# EAGLE design USB_SUPPLY (EAGLE 6.6.0)
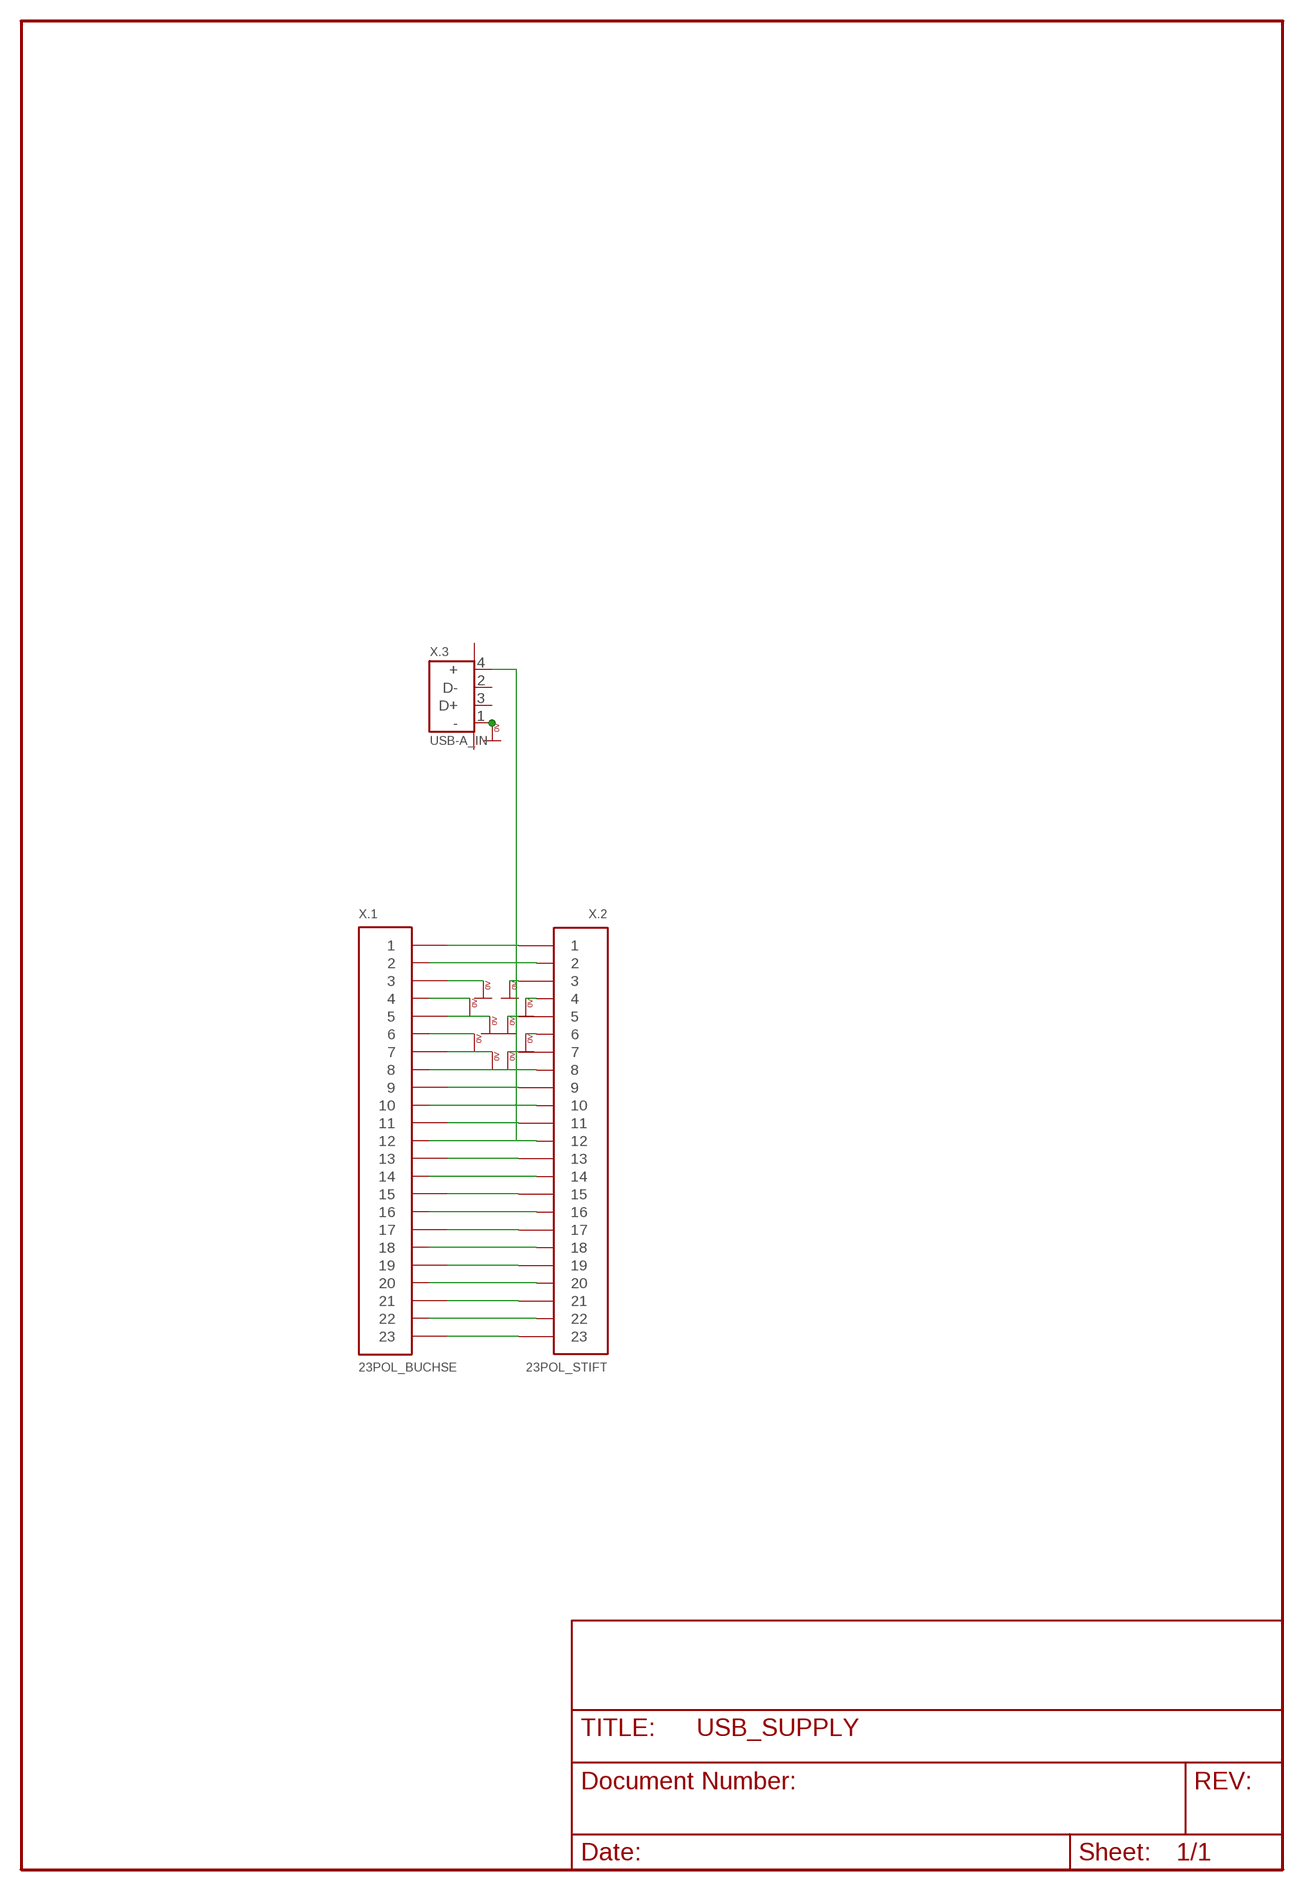
[diagram p0: schematic, sheet 1]

## Parts
X.1  23POL_BUCHSE  [SUB-D_23F_L]
X.2  23POL_STIFT  [SUB-D_23M_L]
X.3  USB-A_IN  [USB-A-90_IN]

## Nets
0V: X.1.3 X.1.4 X.1.5 X.1.6 X.1.7 X.2.3 X.2.4 X.2.5 X.2.6 X.2.7 X.3.1(-)
N$1: X.1.1 X.2.1
N$5: X.1.9 X.2.9
N$6: X.1.11 X.2.11
N$7: X.1.13 X.2.13
N$8: X.1.15 X.2.15
N$9: X.1.17 X.2.17
N$10: X.1.19 X.2.19
N$11: X.1.21 X.2.21
N$12: X.1.23 X.2.23
N$13: X.1.2 X.2.2
N$16: X.1.8 X.2.8
N$17: X.1.10 X.2.10
N$18: X.1.12 X.2.12 X.3.4(+)
N$19: X.1.14 X.2.14
N$20: X.1.16 X.2.16
N$21: X.1.18 X.2.18
N$22: X.1.20 X.2.20
N$23: X.1.22 X.2.22
Unconnected: X.3.2(D-) X.3.3(D+) X.3.P$1(GND) X.3.P$2(GND)

## Library data of the parts
X.1 X.2 = de_connectors:23POL
X.3 = de_connectors:USB-A

## Board
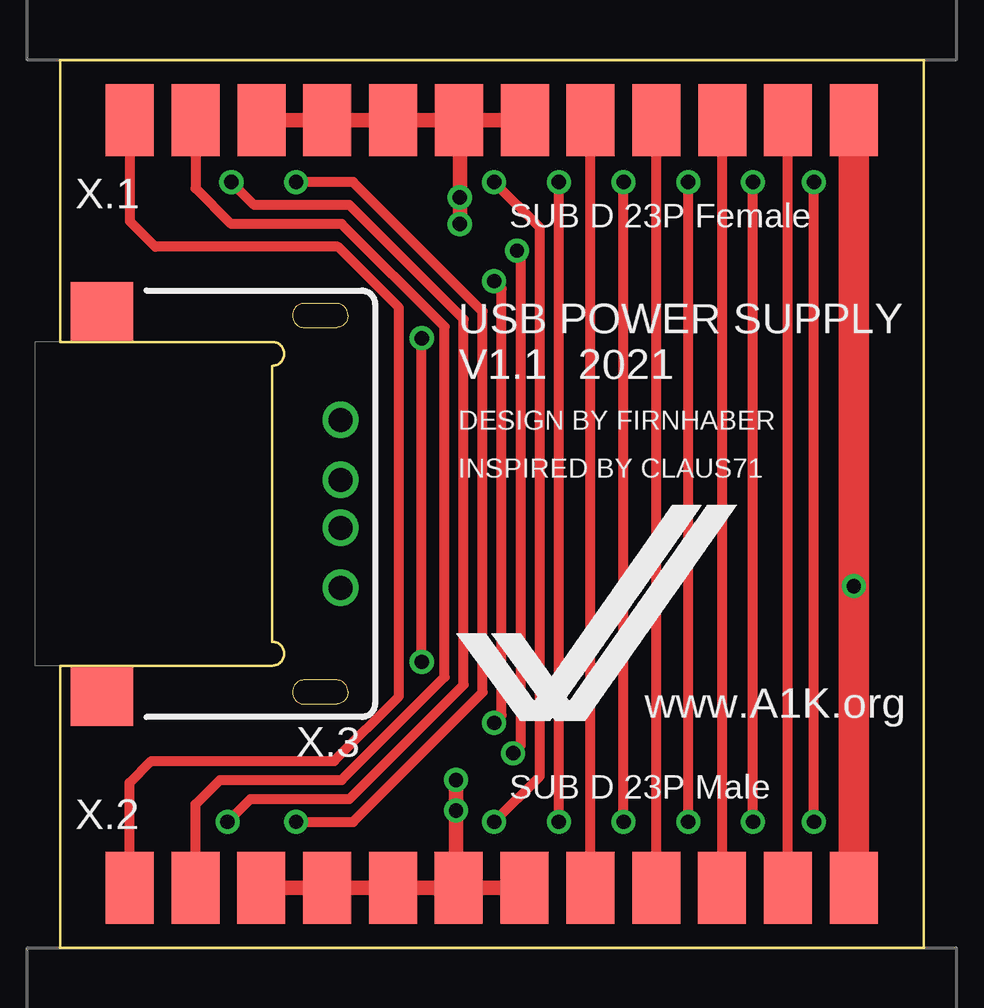
[diagram p1: board, top side]
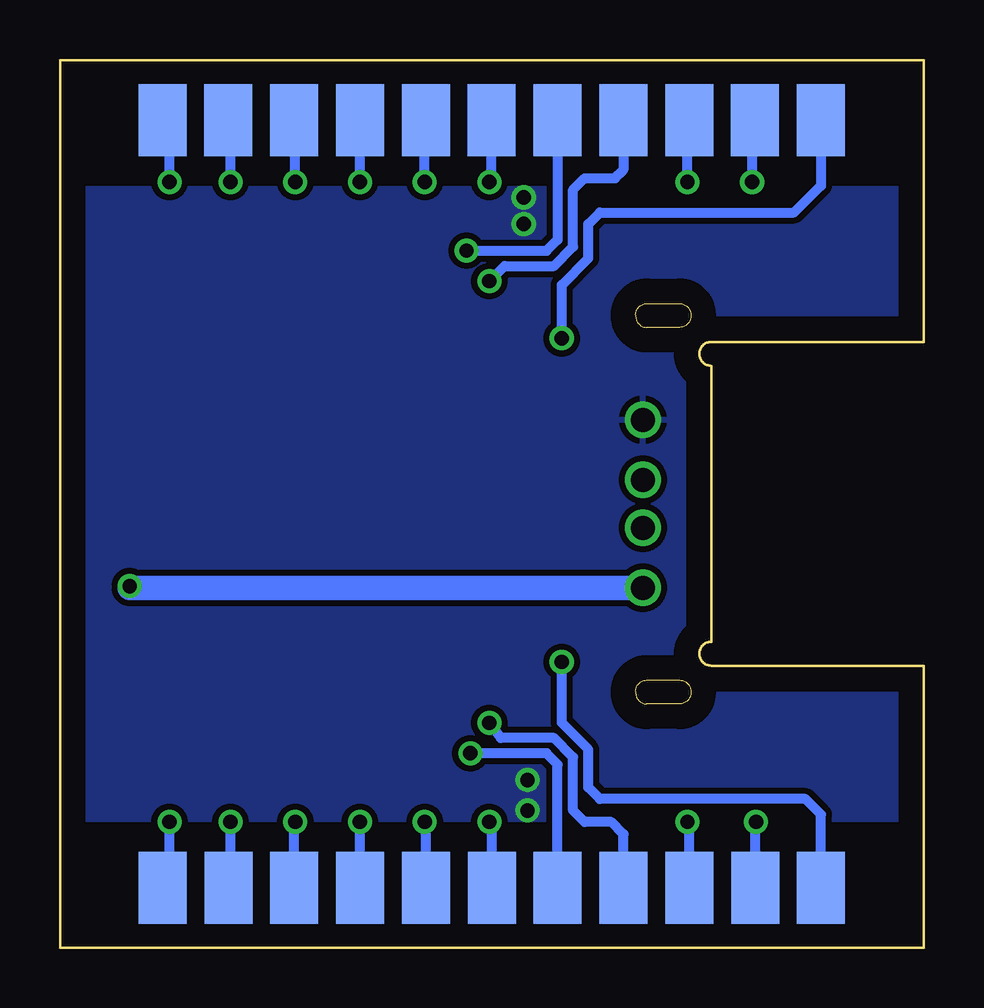
[diagram p2: board, bottom side, seen from below]

Size 36 x 37 mm. Coordinates in mm from the lower left corner, seen from the top.
Outline: 0,0 36,0 36,37 0,37 0,25.25 8.85,25.25 arc-180 8.85,24.25 8.85,12.75 arc-180 8.85,11.75 0,11.75 0,0
Copper layers (1*16): Top 0.035mm / dielectric 1.5mm / Bottom 0.035mm
Design rules "default *": minimum track width 10mil, minimum drill 24mil, track to track 8mil, track to pad 8mil, pad to pad 8mil, via to via 8mil, smd to smd 8mil, copper to edge 40mil, drill to drill 8mil, minimum pad ring 10mil, minimum via ring 8mil, stop-mask expansion 4mil, vias tented up to drill 40mil, thermal gap 10mil
tRestrict: area 0,32 to 36,37; area 0,0 to 36,5
bRestrict: area 0,0 to 36,5; area 0,32 to 36,37

### Footprints (pad centres in the part's own frame; a part is rotated, then mirrored left to right if it is on the bottom)
SUB-D_23F_L = smd 2 x 3: 1 15.092,0.5; 2 12.347,0.5; 3 9.602,0.5; 4 6.857,0.5; 5 4.112,0.5; 6 1.367,0.5; 7 -1.378,0.5; 8 -4.123,0.5; 9 -6.866,0.5; 10 -9.609,0.5; 11 -12.352,0.5; 12 -15.096,0.5 | smd 2 x 3 bottom: 13 13.72,0.5; 14 10.976,0.5; 15 8.23,0.5; 16 5.486,0.5; 17 2.74,0.5; 18 -0.004,0.5; 19 -2.749,0.5; 20 -5.495,0.5; 21 -8.238,0.5; 22 -10.981,0.5; 23 -13.724,0.5
SUB-D_23M_L = smd 2 x 3: 1 -15.096,0.5; 2 -12.352,0.5; 3 -9.609,0.5; 4 -6.866,0.5; 5 -4.123,0.5; 6 -1.378,0.5; 7 1.367,0.5; 8 4.112,0.5; 9 6.857,0.5; 10 9.602,0.5; 11 12.347,0.5; 12 15.092,0.5 | smd 2 x 3 bottom: 13 -13.724,0.5; 14 -10.981,0.5; 15 -8.238,0.5; 16 -5.495,0.5; 17 -2.749,0.5; 18 -0.004,0.5; 19 2.74,0.5; 20 5.486,0.5; 21 8.23,0.5; 22 10.976,0.5; 23 13.72,0.5
USB-A-90_IN = drill 1 pad 1.5: 1 -3.5,2.7; 2 -1,2.7; 3 1,2.7; 4 3.5,2.7 | smd 2.5 x 2.6: P$1 -8,-7.25; P$2 8,-7.25

### Placement (x,y rotation side)
X.1  18,35 180 top
X.2  18,2 0 top
X.3  9,18.5 270 top

### Tracks (layer width: path | path; a pad name or v marks a point on that pad's centre or on a via)
0V  (via drill 0.6)
  Top 0.61: X.2.3 X.2.4 X.2.5 X.2.6 | X.2.6 16.51,2.5 v16.51,6.99 | X.2.6 X.2.7 | X.1.6 16.67,34.46 v16.67,31.27 v16.67,30.16 | X.1.7 X.1.6 | X.1.6 X.1.5 X.1.4 X.1.3
  other vias: 16.51,5.71
  pour Bottom (isolate 0.254): 0,0 0,37 36,37 36,0
N$1
  Top 0.406: X.1.1 2.91,30.27 3.97,29.21 11.59,29.21 14.13,26.67 14.13,10.48 11.43,7.78 3.81,7.78 2.9,6.87 X.2.1
N$5
  Top 0.406: X.2.9 X.1.9
N$6
  Top 0.406: X.2.11 X.1.11
N$7  (via drill 0.6)
  Top 0.406: v15.08,11.91 v15.08,25.4
  Bottom 0.406: X.2.13 4.28,5.55 4.92,6.19 13.49,6.19 13.97,6.67 13.97,8.26 15.08,9.37 v15.08,11.91 | v15.08,25.4 15.08,27.62 13.97,28.73 13.97,30.16 13.49,30.64 5.4,30.64 4.28,31.76 X.1.13
N$8  (via drill 0.6)
  Top 0.406: v9.84,5.24 12.22,5.24 17.62,10.64 17.62,26.51 12.22,31.91 v9.84,31.91
  Bottom 0.406: X.2.15 9.76,5.16 v9.84,5.24 | v9.84,31.91 9.84,34.43 X.1.15
N$9  (via drill 0.6)
  Top 0.406: v18.89,8.1 19.21,8.41 19.21,28.89 v19.05,29.05
  Bottom 0.406: X.2.17 15.25,7.63 15.72,8.1 v18.89,8.1 | v19.05,29.05 15.72,29.05 15.26,29.51 X.1.17
N$10  (via drill 0.6)
  Top 0.406: v20.8,5.24 v20.8,31.91
  Bottom 0.406: X.2.19 20.74,5.18 v20.8,5.24 | v20.8,31.91 20.8,34.45 X.1.19
N$11  (via drill 0.6)
  Top 0.406: v26.19,5.24 v26.19,31.91
  Bottom 0.406: X.2.21 26.23,5.2 v26.19,5.24 | v26.19,31.91 26.19,34.46 X.1.21
N$12  (via drill 0.6)
  Top 0.406: v31.43,5.24 v31.43,31.91
  Bottom 0.406: X.2.23 31.43,2.5 v31.43,5.24 | v31.43,31.91 31.43,33.66 31.72,33.66 X.1.23
N$13
  Top 0.406: X.2.2 5.65,5.97 6.67,6.99 11.75,6.99 16.03,11.27 16.03,25.88 11.75,30.16 7.14,30.16 5.65,31.65 X.1.2
N$16
  Top 0.406: X.2.8 22.12,2.5 X.1.8
N$17
  Top 0.406: X.2.10 X.1.10
N$18  (via drill 0.6)
  Top 1.27: 33.1,2.34 X.2.12 v33.1,15.07 X.1.12
  Bottom 1.016: X.3.4 33.1,15 v33.1,15.07
N$19  (via drill 0.6)
  Top 0.406: v6.99,5.24 7.94,6.19 12.06,6.19 16.83,10.95 16.83,26.19 12.06,30.96 8.1,30.96 v7.14,31.91
  Bottom 0.406: X.2.14 7.02,5.21 v6.99,5.24 | v7.14,31.91 7.14,34.38 X.1.14
N$20  (via drill 0.6)
  Top 0.406: v18.1,9.37 18.41,9.68 18.41,27.46 v18.1,27.78
  Bottom 0.406: X.2.16 12.51,4.73 13.02,5.24 14.13,5.24 14.61,5.71 14.61,7.94 15.4,8.73 17.62,8.73 v18.1,9.37 | v18.1,27.78 17.46,28.42 15.4,28.42 14.61,29.21 14.61,31.59 14.13,32.07 12.86,32.07 12.51,32.41 X.1.16
N$21  (via drill 0.6)
  Top 0.406: v18.1,5.24 20,7.14 20,30 v18.1,31.91
  Bottom 0.406: X.2.18 18,5.14 v18.1,5.24 | v18.1,31.91 18,32 X.1.18
N$22  (via drill 0.6)
  Top 0.406: v23.5,5.24 v23.5,31.91
  Bottom 0.406: X.2.20 23.48,5.23 v23.5,5.24 | v23.5,31.91 X.1.20
N$23  (via drill 0.6)
  Top 0.406: v28.89,5.24 v28.89,31.91
  Bottom 0.406: X.2.22 28.89,2.5 v28.89,5.24 | v28.89,31.91 28.89,33.97 28.98,33.97 X.1.22

### Text on the board
tPlace: SUB D 23P Female | USB POWER SUPPLY | V1.1 | 2021 | DESIGN BY FIRNHABER | INSPIRED BY CLAUS71 | www.A1K.org | SUB D 23P Male